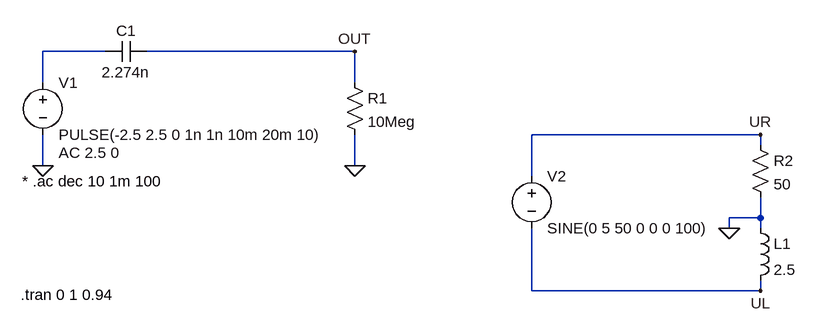
[diagram p0: schematic AC-DC-Kopplung.asc]
AC-DC-Kopplung.asc, the LTspice schematic file:
Version 4
SHEET 1 1280 680
WIRE 176 96 80 96
WIRE 560 96 240 96
WIRE 80 144 80 96
WIRE 560 144 560 96
WIRE 1184 224 832 224
WIRE 1184 240 1184 224
WIRE 80 272 80 224
WIRE 560 272 560 224
WIRE 832 288 832 224
WIRE 1184 352 1184 320
WIRE 1184 352 1136 352
WIRE 1136 368 1136 352
WIRE 1184 368 1184 352
WIRE 832 464 832 368
WIRE 1184 464 1184 448
WIRE 1184 464 832 464
FLAG 80 272 0
FLAG 560 272 0
FLAG 560 96 OUT
FLAG 1136 368 0
FLAG 1184 224 UR
FLAG 1184 464 UL
SYMBOL voltage 80 128 R0
WINDOW 123 24 124 Left 2
WINDOW 39 0 0 Left 0
SYMATTR Value2 AC 2.5 0
SYMATTR InstName V1
SYMATTR Value PULSE(-2.5 2.5 0 1n 1n 10m 20m 10)
SYMBOL res 544 128 R0
SYMATTR InstName R1
SYMATTR Value 10Meg
SYMBOL cap 176 112 R270
WINDOW 0 32 32 VTop 2
WINDOW 3 0 32 VBottom 2
SYMATTR InstName C1
SYMATTR Value 2.274n
SYMBOL ind 1168 352 R0
SYMATTR InstName L1
SYMATTR Value 2.5
SYMATTR SpiceLine Rser=15.6
SYMBOL res 1168 224 R0
SYMATTR InstName R2
SYMATTR Value 50
SYMBOL voltage 832 272 R0
WINDOW 123 0 0 Left 0
WINDOW 39 0 0 Left 0
SYMATTR InstName V2
SYMATTR Value SINE(0 5 50 0 0 0 100)
TEXT 48 296 Left 2 !* .ac dec 10 1m 100
TEXT 46 470 Left 2 !.tran 0 1 0.94

The netlist it stands for:
* AC-DC-Kopplung.asc
V1 N001 0 PULSE(-2.5 2.5 0 1n 1n 10m 20m 10) AC 2.5 0
R1 OUT 0 10Meg
C1 N001 OUT 2.274n
L1 0 UL 2.5 Rser=15.6
R2 UR 0 50
V2 UR UL SINE(0 5 50 0 0 0 100)
* .ac dec 10 1m 100
.tran 0 1 0.94
.backanno
.end